# Altium schematic sheet ASCII_13_USB3_0_power.SchDoc: USB3.0 power
size A4; Organization: Lime Microsystems; Address1: Surrey Tech Centre; Address2: Guildford GU2 7YG; Address3: Surray; Address4: United Kingdom; Revision: v1.4; SheetNumber: 13; SheetTotal: 15
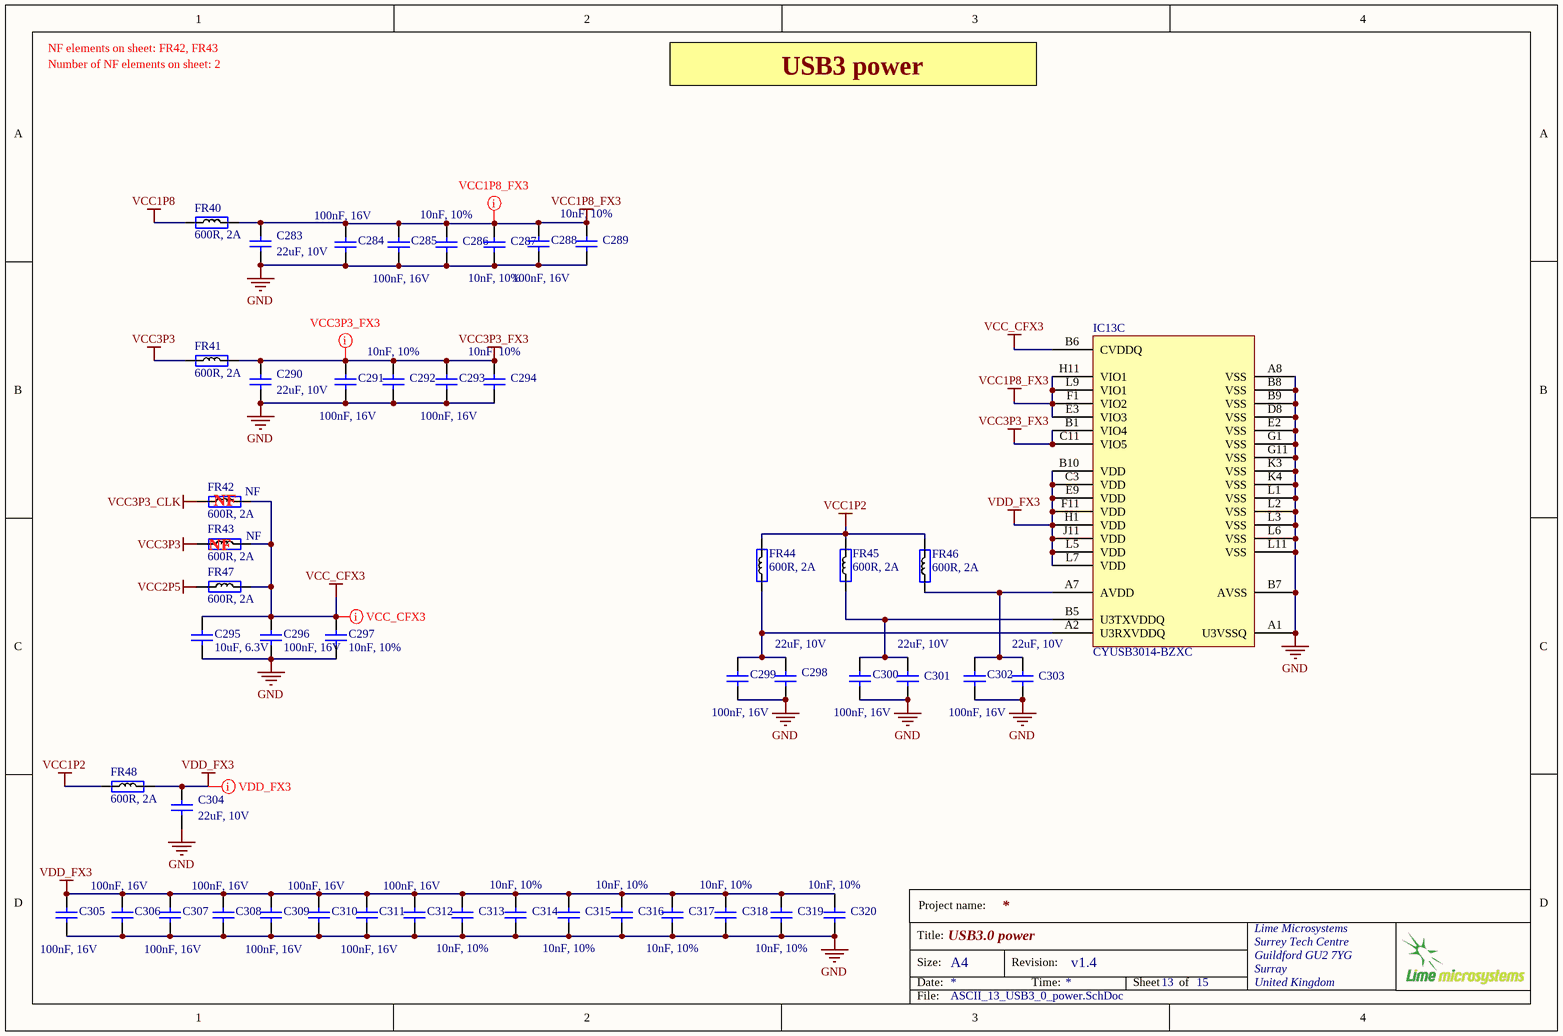
[diagram p0: ASCII_13_USB3_0_power.SchDoc]

## Parts
C283  22uF, 10V  [CAP0603]
C284  100nF, 16V  [CAP0402]
C285  100nF, 16V  [CAP0402]
C286  10nF, 10%  [CAP0402]
C287  10nF, 10%  [CAP0402]
C288  100nF, 16V  [CAP0402]
C289  10nF, 10%  [CAP0402]
C290  22uF, 10V  [CAP0603]
C291  100nF, 16V  [CAP0402]
C292  10nF, 10%  [CAP0402]
C293  100nF, 16V  [CAP0402]
C294  10nF, 10%  [CAP0402]
C295  10uF, 6.3V  [CAP0603]
C296  100nF, 16V  [CAP0402]
C297  10nF, 10%  [CAP0402]
C298  22uF, 10V  [CAP0603]
C299  100nF, 16V  [CAP0402]
C300  100nF, 16V  [CAP0402]
C301  22uF, 10V  [CAP0603]
C302  100nF, 16V  [CAP0402]
C303  22uF, 10V  [CAP0603]
C304  22uF, 10V  [CAP0603]
C305  100nF, 16V  [CAP0402]
C306  100nF, 16V  [CAP0402]
C307  100nF, 16V  [CAP0402]
C308  100nF, 16V  [CAP0402]
C309  100nF, 16V  [CAP0402]
C310  100nF, 16V  [CAP0402]
C311  100nF, 16V  [CAP0402]
C312  100nF, 16V  [CAP0402]
C313  10nF, 10%  [CAP0402]
C314  10nF, 10%  [CAP0402]
C315  10nF, 10%  [CAP0402]
C316  10nF, 10%  [CAP0402]
C317  10nF, 10%  [CAP0402]
C318  10nF, 10%  [CAP0402]
C319  10nF, 10%  [CAP0402]
C320  10nF, 10%  [CAP0402]
FR40  600R, 2A  [RES0805]
FR41  600R, 2A  [RES0805]
FR42  600R, 2A  Assembly Info: NF  [RES0805]
FR43  600R, 2A  Assembly Info: NF  [RES0805]
FR44  600R, 2A  [RES0805]
FR45  600R, 2A  [RES0805]
FR46  600R, 2A  [RES0805]
FR47  600R, 2A  [RES0805]
FR48  600R, 2A  [RES0805]
IC13  CYUSB3014-BZXC  [CYP-BZX121]  (part C of 3)

## Nets
GND: C283.1 C284.2 C285.2 C286.1 C287.1 C288.2 C289.1 C290.1 C291.2 C292.1 C293.2 C294.1 C295.1 C296.2 C297.1 C298.1 C299.2 C300.2 C301.1 C302.2 C303.1 C304.1 C305.2 C306.2 C307.2 C308.2 C309.2 C310.2 C311.2 C312.2 C313.1 C314.1 C315.1 C316.1 C317.1 C318.1 C319.1 C320.1 IC13.A1(U3VSSQ) IC13.A8(VSS) IC13.B7(AVSS) IC13.B8(VSS) IC13.B9(VSS) IC13.D8(VSS) IC13.E2(VSS) IC13.G1(VSS) IC13.G11(VSS) IC13.K3(VSS) IC13.K4(VSS) IC13.L1(VSS) IC13.L2(VSS) IC13.L3(VSS) IC13.L6(VSS) IC13.L11(VSS)
VCC1P2: FR44.2 FR45.2 FR46.2 FR48.1
VCC1P8: FR40.1
VCC1P8_FX3: C283.2 C284.1 C285.1 C286.2 C287.2 C288.1 C289.2 FR40.2 IC13.E3(VIO3) IC13.F1(VIO2) IC13.H11(VIO1) IC13.L9(VIO1)
VCC2P5: FR47.2
VCC3P3: FR41.1 FR43.2
VCC3P3_CLK: FR42.2
VCC3P3_FX3: C290.2 C291.1 C292.2 C293.1 C294.2 FR41.2 IC13.B1(VIO4) IC13.C11(VIO5)
VCC_CFX3: C295.2 C296.1 C297.2 FR42.1 FR43.1 FR47.1 IC13.B6(CVDDQ)
VDD_FX3: C304.2 C305.1 C306.1 C307.1 C308.1 C309.1 C310.1 C311.1 C312.1 C313.2 C314.2 C315.2 C316.2 C317.2 C318.2 C319.2 C320.2 FR48.2 IC13.B10(VDD) IC13.C3(VDD) IC13.E9(VDD) IC13.F11(VDD) IC13.H1(VDD) IC13.J11(VDD) IC13.L5(VDD) IC13.L7(VDD)
NetC298_2: C298.2 C299.1 FR44.1 IC13.A2(U3RXVDDQ)
NetC300_1: C300.1 C301.2 FR45.1 IC13.B5(U3TXVDDQ)
NetC302_1: C302.1 C303.2 FR46.1 IC13.A7(AVDD)

## Layout directives
net class VCC1P8_FX3: VCC1P8_FX3
net class VCC3P3_FX3: VCC3P3_FX3
net class VCC_CFX3: VCC_CFX3
net class VDD_FX3: VDD_FX3

## Notes on the sheet
- Number of NF elements on sheet: 2
- NF elements on sheet: FR42, FR43
- USB3 power
- (near FR42) NF
- (near FR43) NF
- Project name:
- Title:
- Size:
- Date:
- A4
- Revision:
- Time:
- Sheet
- of
- File:

## Library data of the parts
C283 C290 C298 C301 C303 C304 = Cap_0603: Manufacturer Part Number 1: C1608X5R1A226M080AC; Part Description: 22µF ±20% 10V X5R Ceramic Capacitor -55°C ~ 85°C Surface Mount, MLCC 0603 (1608 Metric) 0.063" L x 0.031" W (1.60mm x 0.80mm); Brand: TDK; Temperature Coefficient / Code: +/- 15 %; Tolerance: 20 %; Type: Multilayer Ceramic Chip Capacitor; Supplier 1: Mouser; Supplier Part Number 1: 810-C1608X5R1A226M; Package / Case: 0603 (1608 metric); Category: Multilayer Ceramic Capacitors MLCC - SMD/SMT; Capacitance: 22 uF; Operating Temperature Range: - 55 C to + 85 C; Case Code - in: 0603; Voltage Rating DC: 10 V; Case Code - mm: 1608; Value: 22uF, 10V; Manufacturer: TDK
C284 C285 C288 C291 C293 C296 C299 C300 C302 C305-C312 = Cap_0603: Manufacturer Part Number 1: GRM155R71C104KA88D; Part Description: 0.10µF ±10% 16V X7R Ceramic Capacitor -55°C ~ 125°C Surface Mount, MLCC 0402 (1005 Metric) 0.039" L x 0.020" W (1.00mm x 0.50mm); Brand: Murata Electronics; Tolerance: 10 %; Type: General Purpose MLCC; Capacitance: 0.1 uF; Temperature Coefficient / Code: +/- 15 %; Supplier 1: Mouser; Supplier Part Number 1: 81-GRM155R71C104KA88; Case Code - in: 0402; Manufacturer: Murata Electronics; Category: Multilayer Ceramic Capacitors MLCC - SMD/SMT; Voltage Rating DC: 16 V; Value: 100nF, 16V; Manufacturer Part Number: GRM155R71C104KA88D
C286 C287 C289 C292 C294 C297 C313-C320 = Cap_0603: Part Description: 10000pF ±10% 50V X7R Ceramic Capacitor -55°C ~ 125°C Surface Mount, MLCC 0402 (1005 Metric) 0.039" L x 0.020" W (1.00mm x 0.50mm); Manufacturer: Yageo; Capacitance: 10000pF; Voltage - Rated: 50V; Supplier 1: Digi-Key; Supplier Part Number 1: 311-1349-2-ND; Category: Capacitors; Package / Case: 0402 (1005 Metric); Tolerance: ±10%; Value: 10nF, 10%
C295 = Cap_0603: Manufacturer Part Number 1: CC0603MRX5R5BB106; Part Description: 10µF ±20% 6.3V X5R Ceramic Capacitor -55°C ~ 85°C Surface Mount, MLCC 0603 (1608 Metric) 0.063" L x 0.031" W (1.60mm x 0.80mm); Manufacturer: Yageo; Capacitance: 10µF; Tolerance: ±20%; Supplier 1: Digi-Key; Supplier Part Number 1: 311-1448-2-ND; Package / Case: 0603 (1608 Metric); Category: Capacitors; Voltage - Rated: 6.3V; Value: 10uF, 6.3V
FR40-FR48 = Ferrite: Manufacturer Part Number 1: MPZ2012S601AT000; Manufacturer: TDK Corporation; Part Description: FERRITE BEAD 600 OHM 0805 1LN; DC Resistance (DCR): 100 mOhm Max; Filter Type: Differential Mode - Single; Impedance @ Frequency: 600 Ohm @ 100MHz; Supplier 1: Digi-Key; Supplier Part Number 1: 445-2206-2-ND; Value: 600R, 2A; Category: Filters; Current Rating: 2A; Height (Max): 0.041" (1.05mm); Mounting Type: Surface Mount; Package / Case: 0805 (2012 Metric); Packaging: Tape & Reel (TR); RoHS: RoHS Compliant; Size / Dimension: 0.079" L x 0.049" W (2.00mm x 1.25mm)
IC13 = CYUSB3014-BZXC: EZ-USB(R) FX3: SuperSpeed USB Controller, 512 KB, 60 I/Os, 0 to 70 degC, 121-Pin FBGA (BZX121); Manufacturer: Cypress Semiconductor Corp; CPU Core: ARM926 EJ-S; Max. Operating Voltage (V): 1.25; Memory Architecture: SRAM; Memory Size (KB): 512; Min. Operating Voltage (V): 1.15; No. of I/Os: 60; DatasheetVersion: Rev. *O; PackageVersion: Rev. *D; PackageReference: BZX121; PackageDescription: 121-Ball FBGA, Body 10 x 10 mm, Pitch 0.8 mm; Supplier 1: Digi-Key; Supplier Part Number 1: 428-3182-ND; Supplier 2: Farnell; Supplier Part Number 2: 2355789; Supplier 3: Newark; Supplier Part Number 3: 54W7901; Supplier 4: Mouser; Supplier Part Number 4: 727-CYUSB3014-BZXC; Max. Operating Temp. (degreesC): 70; Min. Operating Temp. (degreesC): 0; RoHS: Pb-Free; Mounting Technology: Surface Mount; Code_JEDEC: PUB 95; PartNumber: CYUSB3014-BZXC; ComponentLink1Description: Manufacturer URL; ComponentLink1URL: http://www.cypress.com/; ComponentLink2Description: Datasheet; ComponentLink2URL: http://www.cypress.com/?docID=49087; ComponentLink3Description: Package Specification; ComponentLink3URL: http://www.cypress.com/?docID=45795; Part Description: EZ-USB(R) FX3: SuperSpeed USB Controller, 512 KB, 60 I/Os, 0 to 70 degC, 121-Pin FBGA (BZX121)